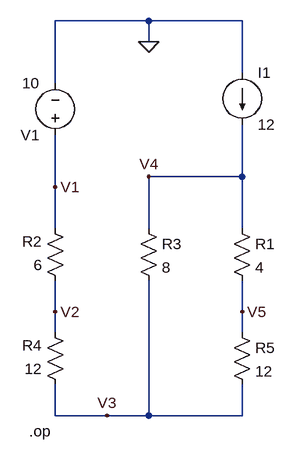
[diagram p0: schematic T1.asc]
T1.asc, the LTspice schematic file:
Version 4
SHEET 1 880 780
WIRE 96 112 -48 112
WIRE 240 112 96 112
WIRE 96 144 96 112
WIRE 240 192 240 112
WIRE -48 208 -48 112
WIRE 240 352 240 272
WIRE 240 352 96 352
WIRE -48 368 -48 288
WIRE -48 432 -48 368
WIRE 96 432 96 352
WIRE 240 432 240 352
WIRE -48 560 -48 512
WIRE 240 560 240 512
WIRE -48 592 -48 560
WIRE 240 592 240 560
WIRE -48 720 -48 672
WIRE 32 720 -48 720
WIRE 96 720 96 512
WIRE 96 720 32 720
WIRE 240 720 240 672
WIRE 240 720 96 720
FLAG 96 144 0
FLAG -48 560 V2
FLAG 32 720 V3
FLAG 96 352 V4
FLAG -48 368 V1
FLAG 240 560 V5
SYMBOL voltage -48 304 R180
WINDOW 123 0 0 Left 0
WINDOW 39 0 0 Left 0
SYMATTR InstName V1
SYMATTR Value 10
SYMBOL current 240 192 R0
WINDOW 123 0 0 Left 0
WINDOW 39 0 0 Left 0
SYMATTR InstName I1
SYMATTR Value 12
SYMBOL res 224 416 R0
SYMATTR InstName R1
SYMATTR Value 4
SYMBOL res -32 528 R180
WINDOW 0 36 76 Left 2
WINDOW 3 36 40 Left 2
SYMATTR InstName R2
SYMATTR Value 6
SYMBOL res 80 416 R0
SYMATTR InstName R3
SYMATTR Value 8
SYMBOL res -32 688 R180
WINDOW 0 36 76 Left 2
WINDOW 3 36 40 Left 2
SYMATTR InstName R4
SYMATTR Value 12
SYMBOL res 224 576 R0
SYMATTR InstName R5
SYMATTR Value 12
TEXT -88 744 Left 2 !.op

The netlist it stands for:
* T1.asc
V1 V1 0 10
I1 0 V4 12
R1 V4 V5 4
R2 V2 V1 6
R3 V4 V3 8
R4 V3 V2 12
R5 V5 V3 12
.op
.backanno
.end